# Altium schematic sheet CurrentSrc.SchDoc
size 420 x 297 mm; Address1: Address1; Address2: Address2; Address3: Address3; Address4: Address4; DocumentNumber: 10; SheetNumber: 10; SheetTotal: 10; Scale: 1:1; Разраб.: Иванов; Обозначение документа: АБВГ.123456.001 Э3; Пров.: Петров; Утв.: Сидоров; Наименование организации: ОАО "Концерн "МПО-Гидроприбор"; Перв. применение: АБВГ.123456.000; Наименование изделия 1: Плата; Наименование изделия 2: Схема электрическая; Наименование изделия 3: принципиальная; Нач. отд.: Нач. отд.; Фамилия нач. отд.: Сидоров
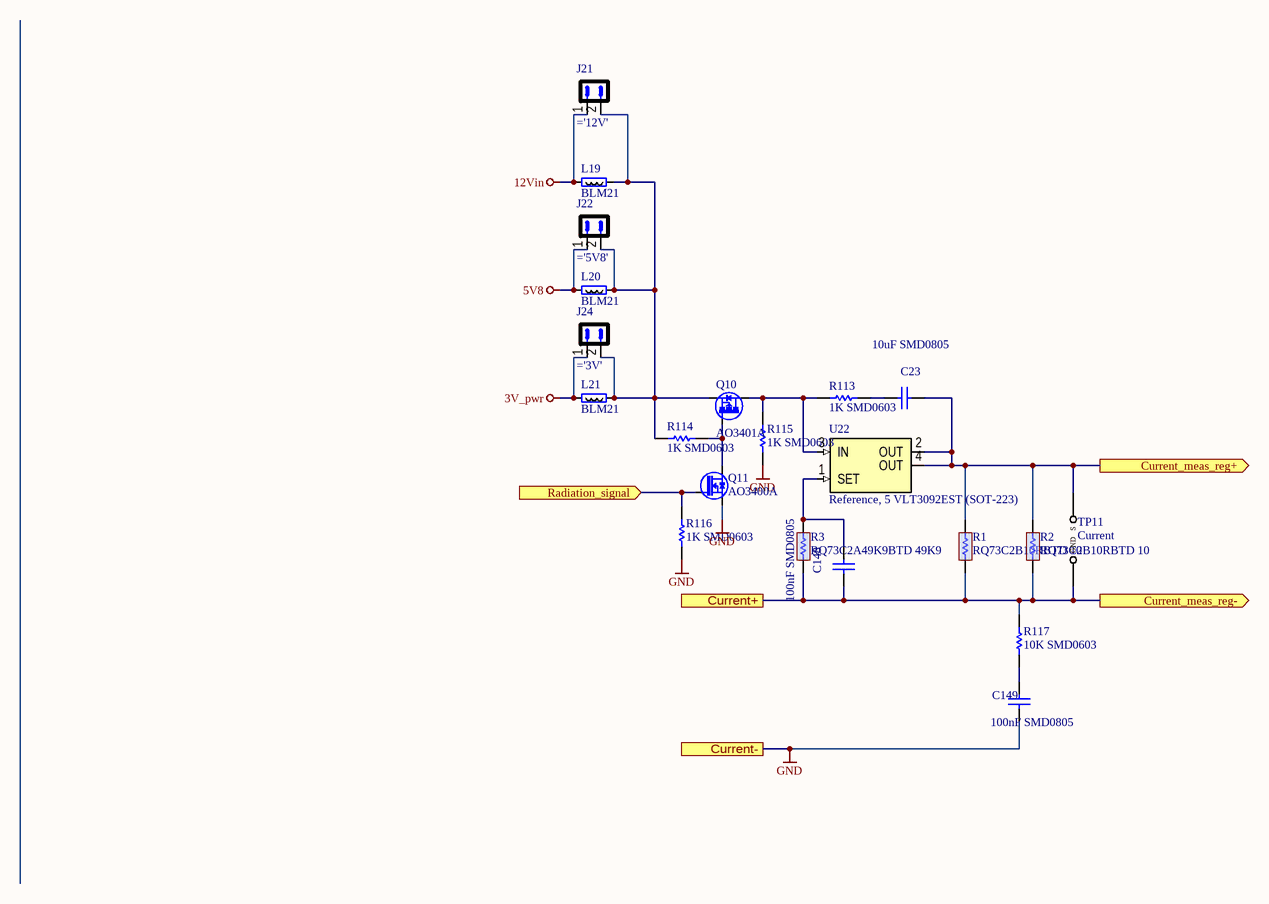
[diagram p0: CurrentSrc.SchDoc]

## Parts
C23  10uF SMD0805  [RESC2012X50N]
C148  100nF SMD0805  [RESC2012X50N]
C149  100nF SMD0805  [RESC2012X50N]  (no BOM)
J21  (no value)  [SAMTEC_TSW-102-23-L-S]
J22  (no value)  [SAMTEC_TSW-102-23-L-S]
J24  (no value)  [SAMTEC_TSW-102-23-L-S]
L19  BLM21  [RESC2012X50N]
L20  BLM21  [RESC2012X50N]
L21  BLM21  [RESC2012X50N]
Q10  AO3401A  [SOT95P229X119-3N]
Q11  AO3400A  [SOT95P229X119-3N]
R1  RQ73C2B10RBTD 10  [RC1206_0805]
R2  RQ73C2B10RBTD 10  [RC1206_0805]
R3  RQ73C2A49K9BTD 49K9  [RESC2012X50N]
R113  1K SMD0603  [0603R]
R114  1K SMD0603  [0603R]
R115  1K SMD0603  [0603R]
R116  1K SMD0603  [0603R]
R117  10K SMD0603  [0603R]  (no BOM)
TP11  Current  [TP2]  (no BOM)
U22  Reference, 5 VLT3092EST (SOT-223)  [SOT223]

## Ports
Current+, Current-, Current_meas_reg+ (out), Current_meas_reg- (out), Radiation_signal (in)

## Nets
3V_pwr: J24.1 L21.2
5V8: J22.1 L20.2
12Vin: J21.1 L19.2
GND: C149.1 Q11.2(S) R115.1 R116.1 ; port Current-
Current+: C148.1 R1.1 R2.1 R3.1 R117.2 TP11.2(GND) ; port Current+, port Current_meas_reg-
Current_meas_reg+: C23.2 R1.2 R2.2 TP11.1(S) U22.2(OUT) U22.4(OUT) ; port Current_meas_reg+
Radiation_signal: Q11.1(G) R116.2 ; port Radiation_signal
NetC23_1: C23.1 R113.2
NetC148_2: C148.2 R3.2 U22.1(SET)
NetC149_2: C149.2 R117.1
NetJ21_2: J21.2 J22.2 J24.2 L19.1 L20.1 L21.1 Q10.2(S) R114.1
NetQ10_1: Q10.1(G) Q11.3(D) R114.2
NetQ10_3: Q10.3(D) R113.1 R115.2 U22.3(IN)

## Notes on the sheet
- Перв. примен.
- Справ. №
- Подп. и дата
- Инв. № дубл.
- Взам. инв. №
- Разраб.
- Изм.
- Лист
- № докум.
- Подп.
- Дата
- Лит.
- Масса
- Масштаб
- Пров.
- Т.контр.
- Листов
- Инв. № подл.
- Утв.
- Н.контр.
- Копировал
- Формат А3

## Library data of the parts
C23 C148 C149 = C0805: Capacitor 0805; SMD Solder: 2; TypeMount: SMD; Package: SMD0805; Footprint: 0805
  C23: Value: 10uF
  C148 C149: Value: 100nF
J21 J22 J24 = PLS2: PartNumber: DS1021-1x2; Vendor: Confly; SMD Solders: 0; Solder Option: RM; THD Solders: 2; TypeMount: THD; Price: 1; Device: PLS2
L19-L21 = BLM21: SMD Ferrite bead 0805; Vendor: Vishay; Value: 1k; Pakage: SMD0805; SMD Solders: 2; Solder Option: RM; Device: BLM21; Price: 10
Q10 = AO3401A: PMOS; Vendor: UMW; Pkg: SOT23; SMD Solders: 3; Solder Option: RM; THD Solders: 0; Voltage: -30V; Price: 10; Device: AO3401A; Name to order: AO3401A
Q11 = AO3400A: NMOS; Vendor: UMW; Pkg: SOT23; SMD Solders: 3; Solder Option: RM; Voltage: 30V; Price: 10; Device: AO3400A; Name to order: AO3400A
R1 R2 = RQ73C2B10RBTD: Precision Resistor, Thin Film, 1206, .4 W, 10 ohm, .1 %, ±10 ppm/°C; Value: 10; Package: None; Price: None; MP: RQ73C2B10RBTD; Availability: Unavailable; PartNumber: RQ73C2B10RBTD
R3 = RQ73C2A49K9BTD: Precision Resistor, Thin Film, 0805, .2 W, 49.9K ohm, .1 %, ±10 ppm/°C; Package: None; Price: None; Value: 49K9; MP: RQ73C2A49K9BTD; Availability: Unavailable; PartNumber: RQ73C2A49K9BTD
R113-R117 = R0603: Resistor 0603; SMD Solder: 2; TypeMount: SMD; Package: SMD0603
  R113-R116: Value: 1K
  R117: Value: 10K
TP11 = OscTP: Контрольная точка для подключения осциллографа короткой землёй; Vendor: PCB; Price: 0; Value: Current; SolderOption: PCB
U22 = LT3092: Reference, 5 V; Name to order: LT3092EST, LT3092IST; SMD Solders: 4; Solder Option: RM; TC: 10ppm/C; Tolerance: 1%; Vendor: Analog Devices Inc; Voltage: max 40V; Current: 10uA; Pkg: SOT-223; Price: 1700; Device: LT3092EST; PartNumber: LT3092EST; Package: SOT-223